# EAGLE design SMeter_RevA (EAGLE 7.6.0)
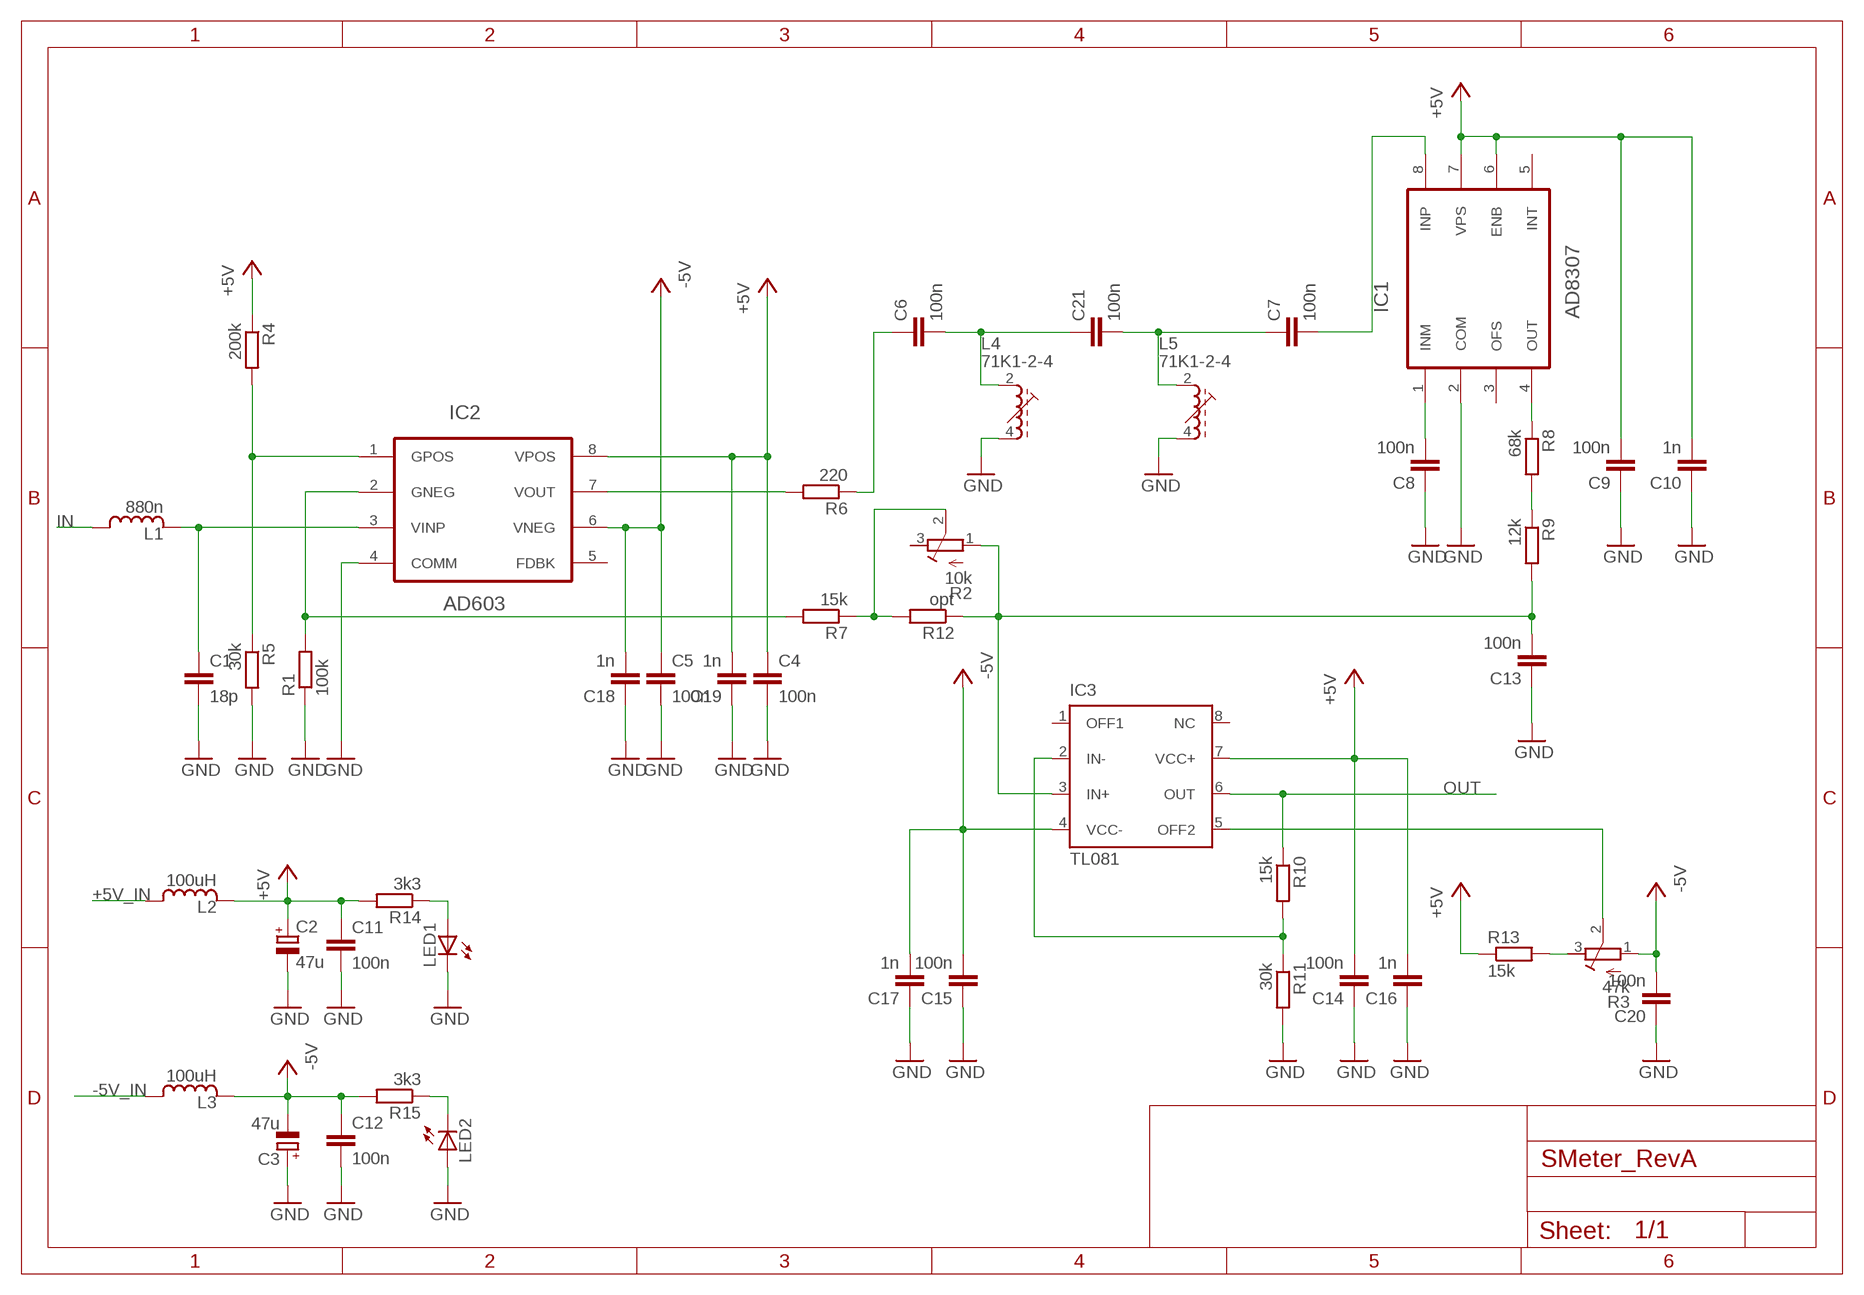
[diagram p0: schematic, sheet 1]

## Parts
C1  18p  CC0805  [C0805]
C2  47u  C_POLARIZEDSMC_B  [SMC_B]
C3  47u  C_POLARIZEDSMC_B  [SMC_B]
C4  100n  CC0805  [C0805]
C5  100n  CC0805  [C0805]
C6  100n  CC0805  [C0805]
C7  100n  CC0805  [C0805]
C8  100n  CC0805  [C0805]
C9  100n  CC0805  [C0805]
C10  1n  CC0805  [C0805]
C11  100n  CC0805  [C0805]
C12  100n  CC0805  [C0805]
C13  100n  CC0805  [C0805]
C14  100n  CC0805  [C0805]
C15  100n  CC0805  [C0805]
C16  1n  CC0805  [C0805]
C17  1n  CC0805  [C0805]
C18  1n  CC0805  [C0805]
C19  1n  CC0805  [C0805]
C20  100n  CC0805  [C0805]
C21  100n  CC0805  [C0805]
IC1  AD8307  [SO8]
IC2  AD603  [SO8]
IC3  TL081  [SOIC8]
L1  880n  INDUCTOR0805  [L0805]
L2  100uH  INDUCTORLPS4018  [LPS4018]
L3  100uH  INDUCTORLPS4018  [LPS4018]
L4  71K1-2-4  [71K]
L5  71K1-2-4  [71K]
LED1  LED0805  [LED0805]
LED2  LED0805  [LED0805]
R1  100k  RESISTORR0805  [R0805]
R2  10k  TRIMMER3224X  [RTRIM3224X]
R3  47k  TRIMMER3224X  [RTRIM3224X]
R4  200k  RESISTORR0805  [R0805]
R5  30k  RESISTORR0805  [R0805]
R6  220  RESISTORR0805  [R0805]
R7  15k  RESISTORR0805  [R0805]
R8  68k  RESISTORR0805  [R0805]
R9  12k  RESISTORR0805  [R0805]
R10  15k  RESISTORR0805  [R0805]
R11  30k  RESISTORR0805  [R0805]
R12  opt  RESISTORR0805  [R0805]
R13  15k  RESISTORR0805  [R0805]
R14  3k3  RESISTORR0805  [R0805]
R15  3k3  RESISTORR0805  [R0805]

## Nets
+5V: C2.+ C4.1 C9.2 C10.2 C11.1 C14.2 C16.2 C19.2 IC1.6(ENB) IC1.7(VPS) IC2.8(VPOS) IC3.7(VCC+) L2.2 R4.1 R13.1 R14.2
+5V_IN: L2.1
-5V: C3.- C5.1 C12.1 C15.2 C17.2 C18.2 C20.2 IC2.6(VNEG) IC3.4(VCC-) L3.2 R3.1(CCW) R15.2
-5V_IN: L3.1
GND: C1.2 C2.- C3.+ C4.2 C5.2 C8.1 C9.1 C10.1 C11.2 C12.2 C13.1 C14.1 C15.1 C16.1 C17.1 C18.1 C19.1 C20.1 IC1.2(COM) IC2.4(COMM) L4.4(E) L5.4(E) LED1.C LED2.A R1.1 R5.2 R11.2
IN: L1.1
N$1: IC2.2(GNEG) R1.2 R7.2
N$2: C1.1 IC2.3(VINP) L1.2
N$3: IC2.1(GPOS) R4.2 R5.1
N$4: IC2.7(VOUT) R6.2
N$5: C6.1 R6.1
N$6: R2.2(WIPER) R7.1 R12.2
N$7: C13.2 IC3.3(IN+) R2.1(CCW) R9.2 R12.1
N$8: LED2.C R15.1
N$9: LED1.A R14.1
N$11: C6.2 C21.1 L4.2(A)
N$12: C7.2 IC1.8(INP)
N$13: C8.2 IC1.1(INM)
N$14: IC1.4(OUT) R8.1
N$15: R8.2 R9.1
N$17: IC3.2(IN-) R10.2 R11.1
N$18: R3.3(CW) R13.2
N$19: IC3.5(OFF2) R3.2(WIPER)
N$20: C7.1 C21.2 L5.2(A)
OUT: IC3.6(OUT) R10.1
Unconnected: IC1.3(OFS) IC1.5(INT) IC2.5(FDBK) IC3.1(OFF1) IC3.8(NC) L4.S1 L4.S2 L5.S1 L5.S2 R2.3(CW)

## Library data of the parts
C1 C4-C21 = 00Capacitor:C: Capacitor
C2 C3 = 00Capacitor:C_POLARIZED
IC1 = 00Amplifier:AD8307: DC to 500 MHz, 92 dB Logarithmic Amplifier
IC2 = 00Amplifier:AD603: Low Noise, 90 MHz Variable Gain Amplifier
IC3 = 00OpAmp:TL081: JFET-Input Operational Amplifiers
L1-L3 = 00Inductor:INDUCTOR
L4 L5 = inductor-neosid:71K1-: FILTER adjustable filter coil, type K; OC_FARNELL: unknown; OC_NEWARK: unknown
LED1 LED2 = 00Display:LED: LED
R1 R4-R15 = 00Resistor:RESISTOR: RESISTOR, European symbol
R2 R3 = 00Resistor:TRIMMER

## Board
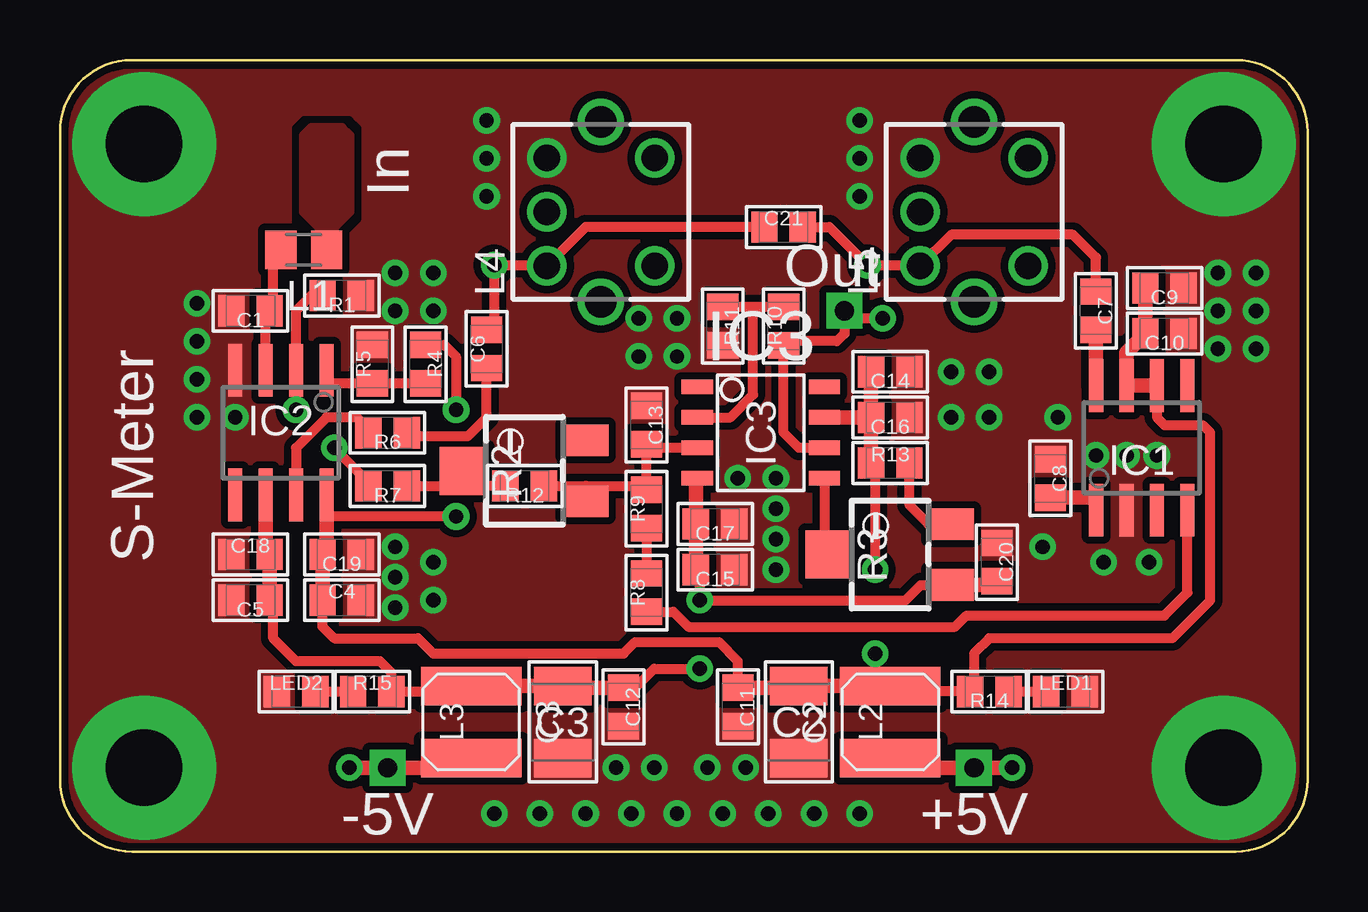
[diagram p1: board, top side]
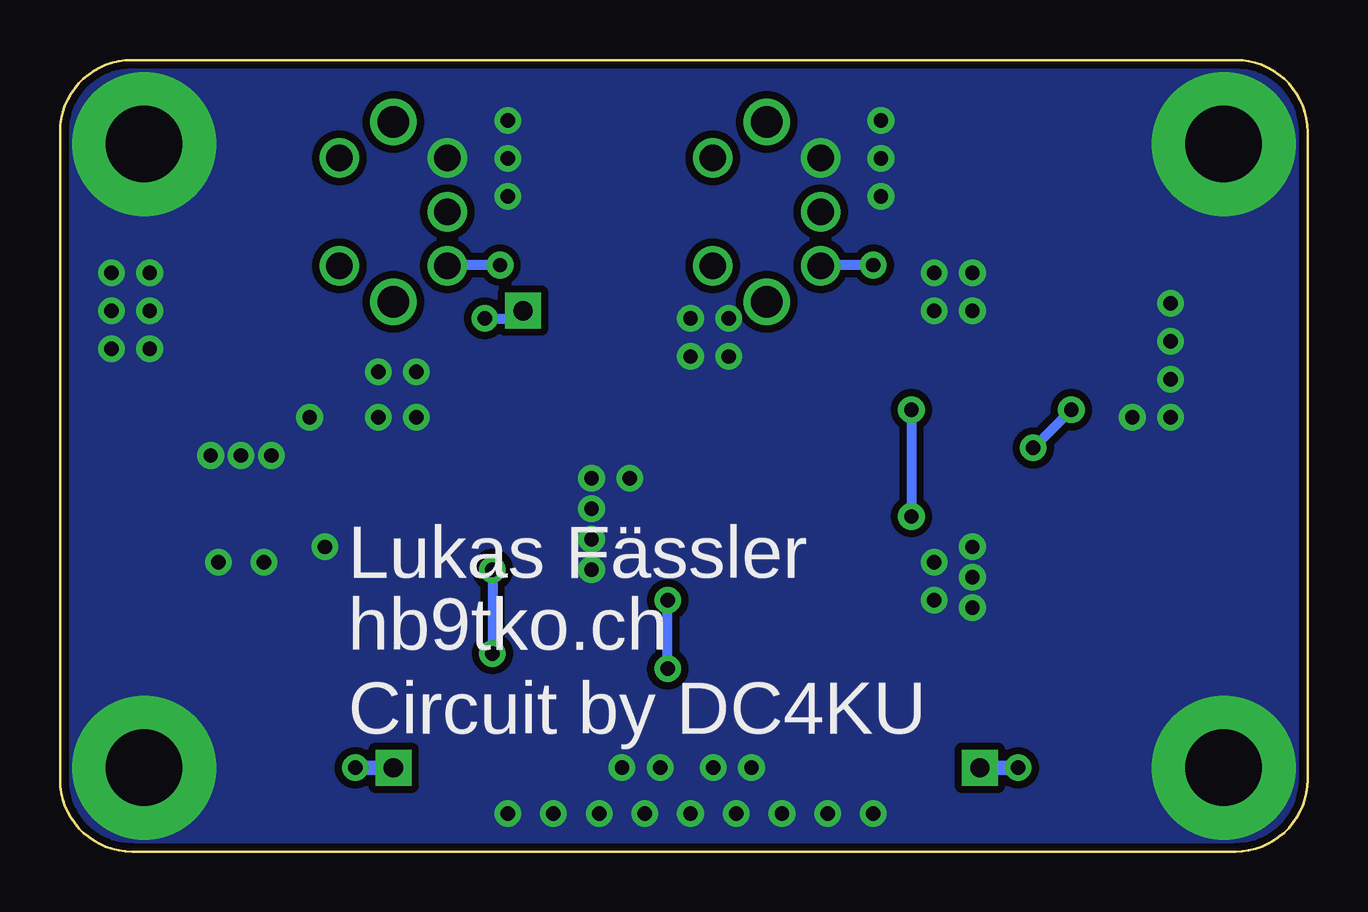
[diagram p2: board, bottom side, seen from below]

Size 52 x 33 mm. Coordinates in mm from the lower left corner, seen from the top.
Outline: 0,30 arc-90 3,33 49,33 arc-90 52,30 52,3 arc-90 49,0 3,0 arc-90 0,3 0,30
Copper layers (1*16): Top 0.035mm / dielectric 1.5mm / Bottom 0.035mm
Design rules "LPKF_Compatible": minimum track width 8mil, minimum drill 23mil, track to track 8mil, track to pad 8mil, pad to pad 8mil, via to via 8mil, smd to smd 0mil, copper to edge 10mil, drill to drill 10mil, minimum pad ring 10mil, minimum via ring 10mil, stop-mask expansion 2mil, vias tented up to drill 25mil, thermal gap 10mil

### Footprints (pad centres in the part's own frame; a part is rotated, then mirrored left to right if it is on the bottom)
C0805 = smd 1.1 x 1.3: 1 -0.8,0; 2 0.8,0
SMC_B = smd 1.6 x 2.4: + -1.5,0; - 1.5,0
SO8 = smd 2.2 x 0.6: 1 -2.6,1.905; 2 -2.6,0.635; 3 -2.6,-0.635; 4 -2.6,-1.905; 5 2.6,-1.905; 6 2.6,-0.635; 7 2.6,0.635; 8 2.6,1.905
SOIC8 = smd 1.3 x 0.6: 1 -2.65,1.905; 2 -2.65,0.635; 3 -2.65,-0.635; 4 -2.65,-1.905; 5 2.65,-1.905; 6 2.65,-0.635; 7 2.65,0.635; 8 2.65,1.905
L0805 = smd 1.3 x 1.6: 1 -0.95,0; 2 0.95,0
LPS4018 = smd 1.6 x 4.2: 1 -1.5,0; 2 1.5,0
71K = drill 1.1: 1 -2.25,-2.25; 2 -2.25,2.25; 3 0,2.25; 4 2.25,2.25; 5 2.25,-2.25 | drill 1.3: S1 -3.75,0; S2 3.75,0
LED0805 = smd 1.1 x 1.3: A -0.8,0; C 0.8,0
R0805 = smd 1.1 x 1.3: 1 -0.8,0; 2 0.8,0
RTRIM3224X = smd 1.32 x 1.9: 1 -1.27,-2.54; 3 1.27,-2.54 | smd 2 x 2: 2 0,2.54

### Placement (x,y rotation side)
C1  7.94,22.54 180 top
C2  30.8,5.4 270 top
C3  20.95,5.4 90 top
C4  11.75,10.48 0 top
C5  7.94,10.48 180 top
C6  17.78,20.95 90 top
C7  43.18,22.54 270 top
C8  41.27,15.56 270 top
C9  46.04,23.5 180 top
C10  46.04,21.59 180 top
C11  28.26,6.03 270 top
C12  23.5,6.03 270 top
C13  24.45,17.78 270 top
C14  34.61,20 180 top
C15  27.3,11.75 180 top
C16  34.61,18.1 180 top
C17  27.3,13.65 180 top
C18  7.94,12.38 0 top
C19  11.75,12.38 180 top
C20  39.05,12.06 270 top
C21  30.16,26.04 0 top
IC1  45.09,16.83 90 top
IC2  9.21,17.46 270 top
IC3  29.21,17.46 0 top
L1  10.16,25.08 180 top
L2  34.61,5.4 90 top
L3  17.14,5.4 90 top
L4  22.54,26.67 90 top
L5  38.1,26.67 90 top
LED1  41.91,6.67 0 top
LED2  9.84,6.67 0 top
R1  11.75,23.18 180 top
R2  19.37,15.88 90 top
R3  34.61,12.38 90 top
R4  15.24,20.32 270 top
R5  13.02,20.32 90 top
R6  13.65,17.46 180 top
R7  13.65,15.24 180 top
R8  24.45,10.79 90 top
R9  24.45,14.29 90 top
R10  30.16,21.91 90 top
R11  27.62,21.91 270 top
R12  19.37,15.24 180 top
R13  34.61,16.19 0 top
R14  38.73,6.67 180 top
R15  13.02,6.67 0 top

### Tracks (layer width: path | path; a pad name or v marks a point on that pad's centre or on a via)
+5V  (via drill 0.6)
  Top 0.406: 30.8,6.83 C2.+ | IC1.6 45.72,18.1 46.04,17.78 47.62,17.78 47.94,17.46 47.94,10.48 46.35,8.89 38.73,8.89 38.1,8.26 38.1,6.83 R14.2 34.84,6.67 L2.2 | R13.1 33.97,16.03 v33.97,11.75 | C4.1 10.95,9.37 11.43,8.89 14.92,8.89 15.56,8.26 23.5,8.26 23.97,8.73 27.46,8.73 28.26,7.94 C11.1 | R4.1 16.03,21.12 16.51,20.64 v16.51,18.41 | v16.51,13.97 11.11,13.97 | v33.97,8.26 33.97,6.9
  Top 0.61: IC3.7 C16.2 | C16.2 C14.2 | C16.2 R13.1 | C9.2 C10.2 44.45,20.8 IC1.7 IC1.6 | C4.1 C19.2 11.11,12.55 11.11,13.97 IC2.8 | C11.1 30.73,6.83 C2.+ 33.97,6.9 L2.2
  Bottom 0.406: v33.97,11.75 v33.97,8.26 | v16.51,18.41 v16.51,13.97
+5V_IN  (via drill 0.6, 0.8 pad 1.5)
  Top 0.406: 34.61,3.49 L2.1
  Top 0.61: 34.61,3.49 v38.1,3.49 v39.69,3.49
  Bottom 0.61: v39.69,3.49 v38.1,3.49
-5V  (via drill 0.6)
  Top 0.406: 20.95,7.15 C3.- 20.95,6.83 | IC3.4 26.5,15.5 | R3.1 35.88,11.11 35.24,10.48 v26.67,10.48 26.67,11.58 C15.2 | C12.1 23.98,6.83 24.77,7.62 v26.67,7.62 | L3.2 16.91,6.67 R15.2 13.82,7.46 13.34,7.94 9.84,7.94 8.89,8.89 8.89,10.32 C5.1
  Top 0.61: 26.5,15.5 C17.2 C15.2 | C5.1 C18.2 8.57,12.55 IC2.6 | 20.95,6.83 C12.1 | R3.1 38.9,11.11 C20.2 | C3.- 17.87,6.9 17.78,6.99 17.23,6.99 L3.2
  Bottom 0.406: v26.67,7.62 v26.67,10.48
-5V_IN  (via drill 0.6, 0.8 pad 1.5)
  Top 0.406: 16.99,3.49 arc90 L3.1
  Top 0.61: 16.99,3.49 v13.65,3.49 v12.06,3.49
  Bottom 0.61: v12.06,3.49 v13.65,3.49
GND  (via drill 0.6, 3.2 pad 6)
  other vias: 3.5,29.5 48.5,29.5 48.5,3.5 3.5,3.5 28.26,15.56 29.84,14.29 29.84,15.56 29.84,13.02 29.84,11.75 38.73,20 38.73,18.1 37.15,20 37.15,18.1 41.59,18.1 25.72,20.64 25.72,22.23 23.81,1.59 27.62,1.59 25.72,1.59 23.18,3.49 24.77,3.49 18.1,1.59 26.99,3.49 28.57,3.49 29.53,1.59 31.43,1.59 20,1.59 21.91,1.59 24.13,22.23 24.13,20.64 43.18,16.51 44.45,16.51 45.72,16.51 43.5,12.06 45.4,12.06 48.26,24.13 48.26,22.54 48.26,20.95 49.85,20.95 49.85,22.54 49.85,24.13 13.97,12.7 13.97,11.43 13.97,10.16 15.56,10.48 15.56,12.06 33.34,1.59 5.71,22.86 5.71,21.27 5.71,19.68 5.71,18.1 13.97,24.13 13.97,22.54 15.56,22.54 15.56,24.13 7.3,18.1 40.96,12.7 17.78,30.48 17.78,28.89 17.78,27.3 33.34,30.48 33.34,28.89 33.34,27.3
  pour Bottom (isolate 0.305, no thermals): 0,1 0,32 arc-90 1,33 51,33 arc-90 52,32 52,1 arc-90 51,0 1,0 arc-90
  pour Top (isolate 0.305, rank 2, no thermals): 0,1 0,32 arc-90 1,33 51,33 arc-90 52,32 52,1 arc-90 51,0 1,0 arc-90
IN
  pour Top (isolate 0.305, no thermals): 11.43,25.08 11.43,26.04 12.06,26.67 12.06,29.84 11.75,30.16 10.48,30.16 10.16,29.84 10.16,26.67 10.79,26.04 10.79,25.08
N$1  (via drill 0.6)
  Top 0.406: R1.2 10.48,23.18 9.84,22.54 IC2.2 v9.84,18.41 | R7.2 12.85,15.4 v11.43,16.83
  Bottom 0.406: v9.84,18.41 v11.43,16.83
N$2
  Top 0.406: IC2.3 8.57,22.38 C1.1 8.74,22.71 8.89,22.86 8.89,24.76 L1.2
N$3
  Top 0.406: R4.2 R5.1 11.11,19.52 IC2.1
N$4
  Top 0.406: R6.2 12.85,17.63 12.38,18.1 11.11,18.1 9.84,16.83 IC2.7
N$5
  Top 0.406: C6.1 17.78,18.1 16.99,17.3 14.61,17.3 R6.1
N$6
  Top 0.406: R7.1 16.19,15.24 R2.2 17.46,15.24 R12.2
N$7
  Top 0.406: IC3.3 24.6,16.83 C13.2 R9.2 24.3,15.24 21.91,15.24 | R12.1 21.91,15.24 | R2.1 21.91,15.24
N$8
  Top 0.406: LED2.C R15.1
N$9
  Top 0.406: R14.1 LED1.A
N$11  (via drill 0.6)
  Top 0.406: C21.1 21.91,26.04 L4.2 20.27,24.45 v18.1,24.45 18.1,22.07 C6.2
  Bottom 0.406: v18.1,24.45 20.32,24.45
N$12
  Top 0.61: IC1.8 C7.2
N$13
  Top 0.61: C8.2 43.18,14.76 IC1.1
N$14
  Top 0.406: IC1.4 46.99,10.79 46.04,9.84 37.78,9.84 37.31,9.37 26.19,9.37 25.57,9.99 R8.1
N$15
  Top 0.406: R9.1 R8.2
N$17
  Top 0.406: R10.2 28.89,22.71 | 28.89,22.71 R11.1 | IC3.2 27.94,18.1 28.89,19.05 28.89,22.71
N$18
  Top 0.406: R3.3 36.2,13.65 35.41,14.44 R13.2
N$19
  Top 0.406: IC3.5 31.86,12.59 R3.2
N$20  (via drill 0.6)
  Top 0.406: C7.1 43.18,24.77 42.23,25.72 37.15,25.72 L5.2 33.68,24.42 v33.66,24.45 32.07,26.04 C21.2
  Bottom 0.406: v33.66,24.45 35.88,24.45
OUT  (via drill 0.6, 0.8 pad 1.5)
  Top 0.406: IC3.6 30.8,16.83 30.16,17.46 R10.1 30.33,21.27 32.38,21.27 32.7,21.59 v32.7,22.54 33.02,22.23 v34.29,22.23
  Bottom 0.406: v34.29,22.23 33.02,22.23 v32.7,22.54

### Text on the board
tPlace: In | Out | S-Meter | -5V | +5V
bPlace: Lukas Fässler | hb9tko.ch | Circuit by DC4KU